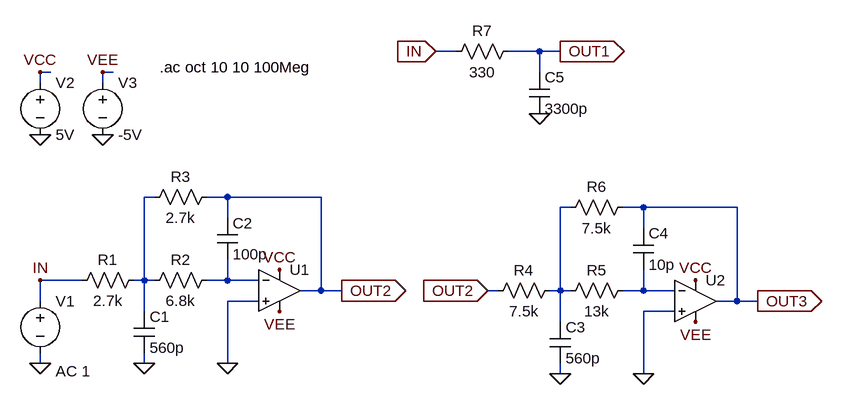
[diagram p0: schematic Chebyshev_LPF_4th.asc]
Chebyshev_LPF_4th.asc, the LTspice schematic file:
Version 4
SHEET 1 1072 680
WIRE 416 -224 384 -224
WIRE 544 -224 496 -224
WIRE 576 -224 544 -224
WIRE -208 -192 -224 -192
WIRE -112 -192 -128 -192
WIRE 544 -192 544 -224
WIRE -224 -176 -224 -192
WIRE -128 -176 -128 -192
WIRE -48 0 -64 0
WIRE 64 0 32 0
WIRE 208 0 64 0
WIRE 592 16 576 16
WIRE 704 16 672 16
WIRE 848 16 704 16
WIRE 64 32 64 0
WIRE 704 48 704 16
WIRE -160 128 -224 128
WIRE -64 128 -64 0
WIRE -64 128 -80 128
WIRE -48 128 -64 128
WIRE 64 128 64 96
WIRE 64 128 32 128
WIRE 112 128 64 128
WIRE 208 144 208 0
WIRE 208 144 176 144
WIRE 240 144 208 144
WIRE 480 144 464 144
WIRE 576 144 576 16
WIRE 576 144 560 144
WIRE 592 144 576 144
WIRE 704 144 704 112
WIRE 704 144 672 144
WIRE 752 144 704 144
WIRE -224 160 -224 128
WIRE 112 160 64 160
WIRE 848 160 848 16
WIRE 848 160 816 160
WIRE 880 160 848 160
WIRE -64 176 -64 128
WIRE 752 176 704 176
WIRE 576 192 576 144
WIRE -224 256 -224 240
WIRE -64 256 -64 240
WIRE 64 256 64 160
WIRE 576 272 576 256
WIRE 704 272 704 176
FLAG -64 256 0
FLAG 64 256 0
FLAG 240 144 OUT2
IOPIN 240 144 Out
FLAG -224 256 0
FLAG -224 -96 0
FLAG -128 -96 0
FLAG -224 -192 VCC
FLAG -128 -192 VEE
FLAG 144 112 VCC
FLAG 144 176 VEE
FLAG 576 272 0
FLAG 704 272 0
FLAG 880 160 OUT3
IOPIN 880 160 Out
FLAG 784 128 VCC
FLAG 784 192 VEE
FLAG 464 144 OUT2
IOPIN 464 144 In
FLAG -224 128 IN
FLAG 384 -224 IN
IOPIN 384 -224 In
FLAG 544 -128 0
FLAG 576 -224 OUT1
IOPIN 576 -224 Out
SYMBOL Opamps\\UniversalOpamp2 144 144 R0
SYMATTR InstName U1
SYMBOL res -64 112 R90
WINDOW 0 0 56 VBottom 2
WINDOW 3 32 56 VTop 2
SYMATTR InstName R1
SYMATTR Value 2.7k
SYMBOL res 48 112 R90
WINDOW 0 0 56 VBottom 2
WINDOW 3 32 56 VTop 2
SYMATTR InstName R2
SYMATTR Value 6.8k
SYMBOL res 48 -16 R90
WINDOW 0 0 56 VBottom 2
WINDOW 3 32 56 VTop 2
SYMATTR InstName R3
SYMATTR Value 2.7k
SYMBOL cap -80 176 R0
SYMATTR InstName C1
SYMATTR Value 560p
SYMBOL cap 48 32 R0
SYMATTR InstName C2
SYMATTR Value 100p
SYMBOL voltage -224 144 R0
WINDOW 123 24 124 Left 2
WINDOW 39 0 0 Left 2
SYMATTR Value2 AC 1
SYMATTR InstName V1
SYMATTR Value ""
SYMBOL voltage -224 -192 R0
WINDOW 123 0 0 Left 2
WINDOW 39 0 0 Left 2
SYMATTR InstName V2
SYMATTR Value 5V
SYMBOL voltage -128 -192 R0
WINDOW 123 0 0 Left 2
WINDOW 39 0 0 Left 2
SYMATTR InstName V3
SYMATTR Value -5V
SYMBOL Opamps\\UniversalOpamp2 784 160 R0
SYMATTR InstName U2
SYMBOL res 576 128 R90
WINDOW 0 0 56 VBottom 2
WINDOW 3 32 56 VTop 2
SYMATTR InstName R4
SYMATTR Value 7.5k
SYMBOL res 688 128 R90
WINDOW 0 0 56 VBottom 2
WINDOW 3 32 56 VTop 2
SYMATTR InstName R5
SYMATTR Value 13k
SYMBOL res 688 0 R90
WINDOW 0 0 56 VBottom 2
WINDOW 3 32 56 VTop 2
SYMATTR InstName R6
SYMATTR Value 7.5k
SYMBOL cap 560 192 R0
SYMATTR InstName C3
SYMATTR Value 560p
SYMBOL cap 688 48 R0
SYMATTR InstName C4
SYMATTR Value 10p
SYMBOL res 512 -240 R90
WINDOW 0 0 56 VBottom 2
WINDOW 3 32 56 VTop 2
SYMATTR InstName R7
SYMATTR Value 330
SYMBOL cap 528 -192 R0
SYMATTR InstName C5
SYMATTR Value 3300p
TEXT -40 -200 Left 2 !.ac oct 10 10 100Meg

The netlist it stands for:
* Chebyshev_LPF_4th.asc
XU1 0 N003 VCC VEE OUT2 level.2 Avol=1Meg GBW=10Meg Slew=10Meg ilimit=25m rail=0 Vos=0 phimargin=45 en=0 enk=0 in=0 ink=0 Rin=500Meg  ; pins IN+ IN- V+ V- OUT
R1 N001 IN 2.7k
R2 N003 N001 6.8k
R3 OUT2 N001 2.7k
C1 N001 0 560p
C2 OUT2 N003 100p
V1 IN 0 AC 1
V2 VCC 0 5V
V3 VEE 0 -5V
XU2 0 N004 VCC VEE OUT3 level.2 Avol=1Meg GBW=10Meg Slew=10Meg ilimit=25m rail=0 Vos=0 phimargin=45 en=0 enk=0 in=0 ink=0 Rin=500Meg  ; pins IN+ IN- V+ V- OUT
R4 N002 OUT2 7.5k
R5 N004 N002 13k
R6 OUT3 N002 7.5k
C3 N002 0 560p
C4 OUT3 N004 10p
R7 OUT1 IN 330
C5 OUT1 0 3300p
.ac oct 10 10 100Meg
.lib UniversalOpamps2.sub
.backanno
.end